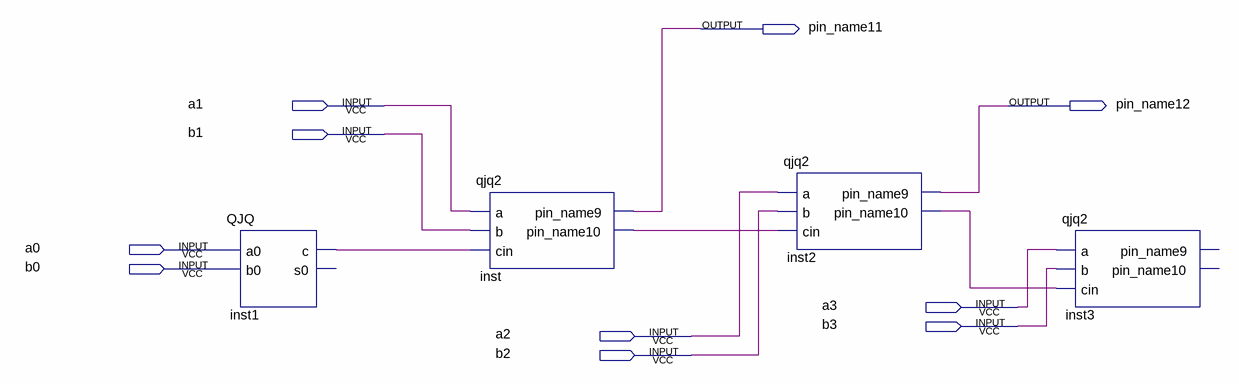
[diagram p0: schematic sheet]
// Quartus schematic qjq3.bdf as structural Verilog: 4 symbols, 10 pins
module qjq3 (
  input  a1,
  input  b1,
  input  a0,
  input  b0,
  input  a3,
  input  b3,
  input  a2,
  input  b2,
  output pin_name11,
  output pin_name12
);

  wire inst1_c, inst2_pin_name10, inst_pin_name10;

  QJQ inst1 (.a0(a0), .b0(b0), .c(inst1_c));  // open: s0
  qjq2 inst (.a(a1), .b(b1), .cin(inst1_c), .pin_name9(pin_name11), .pin_name10(inst_pin_name10));
  qjq2 inst2 (.a(a2), .b(b2), .cin(inst_pin_name10), .pin_name9(pin_name12), .pin_name10(inst2_pin_name10));
  qjq2 inst3 (.a(a3), .b(b3), .cin(inst2_pin_name10));  // open: pin_name9, pin_name10
endmodule
